# EAGLE design smogbuster-v2 (EAGLE 9.2.2)
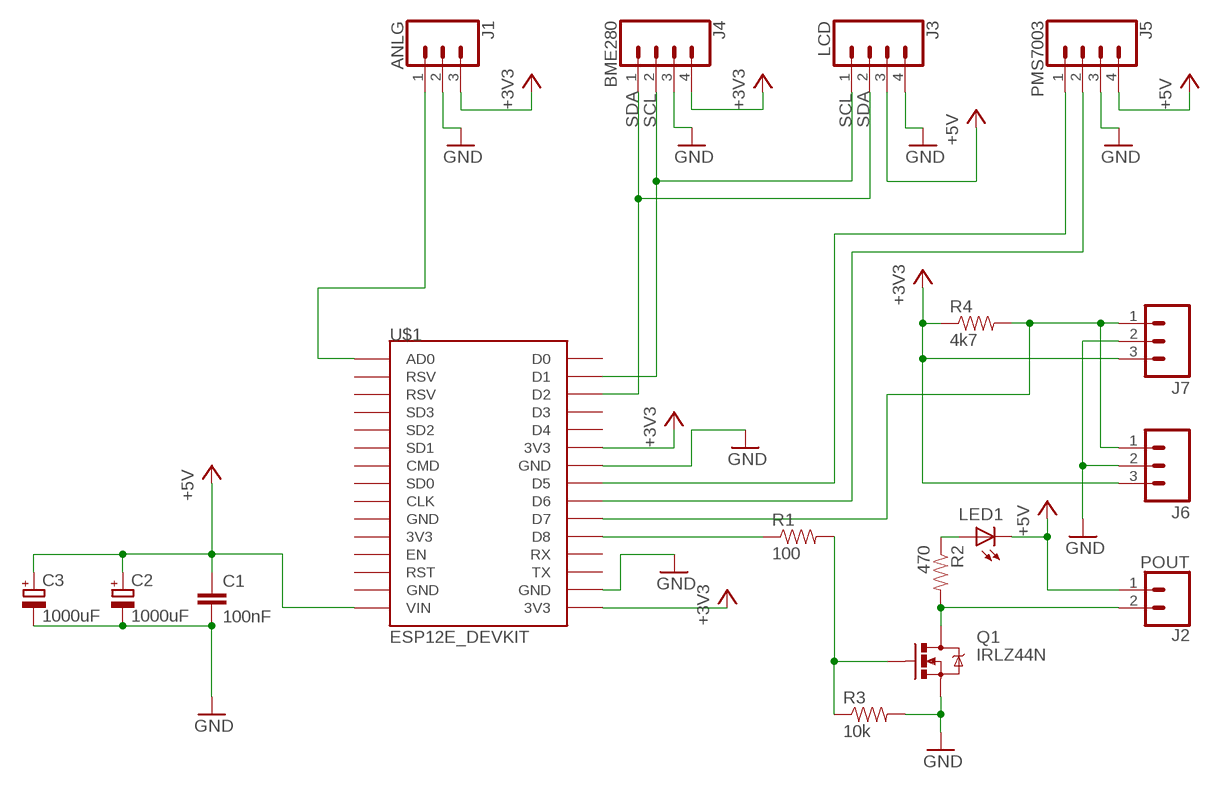
[diagram p0: schematic, sheet 1]

## Parts
C1  100nF  CAPPTH1  [CAP-PTH-5MM]
C2  1000uF  CPOL-EUE2.5-7  [E2,5-7]
C3  1000uF  CPOL-EUE2.5-7  [E2,5-7]
J1  ANLG  CONN_03  [1X03]
J2  POUT  CONN_02  [1X02]
J3  LCD  CONN_04  [1X04]
J4  BME280  CONN_04  [1X04]
J5  PMS7003  CONN_04  [1X04]
J6  M03PTH  [1X03]
J7  M03PTH  [1X03]
LED1  LED3MM  [LED3MM]
Q1  IRLZ44N  MOSFET-NCHANNELFQP30N06L  [TO220V]
R1  100  1KOHM-1/4W-1%(PTH)  [AXIAL-0.3]
R2  470  1KOHM-1/4W-1%(PTH)  [AXIAL-0.3]
R3  10k  1KOHM-1/4W-1%(PTH)  [AXIAL-0.3]
R4  4k7  1KOHM-1/4W-1%(PTH)  [AXIAL-0.3]
U$1  ESP12E_DEVKIT  [ESP12E_DEVKIT]

## Nets
+3V3: J1.3 J4.4 J6.3 J7.3 R4.P$1 U$1.3V3@1(3V3) U$1.3V3@2(3V3)
+5V: C1.1 C2.+ C3.+ J2.1 J3.3 J5.4 LED1.K(C) U$1.VIN
DQ: J6.1 J7.1 R4.P$2 U$1.D7
GND: C1.2 C2.- C3.- J1.2 J3.4 J4.3 J5.3 J6.2 J7.2 Q1.3(S) R3.P$2 U$1.GND@2(GND) U$1.GND@3(GND)
N$2: J2.2 Q1.2(D) R2.P$2
N$3: Q1.1(G) R1.P$2 R3.P$1
N$4: J1.1 U$1.AD0
N$5: R1.P$1 U$1.D8
N$9: LED1.A R2.P$1
RX: J5.1 U$1.D5
SCL: J3.1 J4.2 U$1.D1
SDA: J3.2 J4.1 U$1.D2
TX: J5.2 U$1.D6
Unconnected: U$1.3V3@0(3V3) U$1.CLK U$1.CMD U$1.D0 U$1.D3 U$1.D4 U$1.EN U$1.GND@0(GND) U$1.GND@1(GND) U$1.RST U$1.RSV@0(RSV) U$1.RSV@1(RSV) U$1.RX U$1.SD0 U$1.SD1 U$1.SD2 U$1.SD3 U$1.TX

## Library data of the parts
C1 = SparkFun-Capacitors:CAP: Capacitor Standard 0603 ceramic capacitor, and 0.1" leaded capacitor.
C2 C3 = rcl:CPOL-EU: POLARIZED CAPACITOR, European symbol; SPICEPREFIX: C
J1 = SparkFun-Connectors:CONN_03: Multi connection point. Often used as Generic Header-pin footprint for 0.1 inch spaced/style header connections On any of the 0.1 inch spaced packages, you can populate with these: Break Away Headers - Straight <https://www.sparkfun.com/products/116> (PRT-00116) Break Away Male Headers - Right Angle <https://www.sparkfun.com/products/553> (PRT-00553) Female Headers <https://www.sparkfun.com/products/115> (PRT-00115) Break Away Headers - Machine Pin <https://www.sparkfun.com/products/117> (PRT-00117) Break Away Female Headers - Swiss Machine Pin <https://www.sparkfun.com/products/743> (PRT-00743) Stackable Header - 3 Pin (Female, 0.1") <https://www.sparkfun.com/products/13875> (PRT-13875) For SCREWTERMINALS and SPRING TERMINALS visit here: Screw Terimnals on SparkFun.com <https://www.sparkfun.com/search/results?term=Screw+Terminals> (5mm/3.5mm/2.54mm spacing) This device is also useful as a general connection point to wire up your design to another part of your project. Our various solder wires solder well into these plated through hole pads. Hook-Up Wire - Assortment (Stranded, 22 AWG) <https://www.sparkfun.com/products/11375> (PRT-11375) Hook-Up Wire - Assortment (Solid Core, 22 AWG) <https://www.sparkfun.com/products/11367> (PRT-11367) View the entire wire category on our website here <https://www.sparkfun.com/categories/141> Special notes: Molex polarized connector foot print use with SKU : PRT-08232 with associated crimp pins and housings.
J2 = SparkFun-Connectors:CONN_02: Multi connection point. Often used as Generic Header-pin footprint for 0.1 inch spaced/style header connections On any of the 0.1 inch spaced packages, you can populate with these: Break Away Headers - Straight <https://www.sparkfun.com/products/116> (PRT-00116) Break Away Male Headers - Right Angle <https://www.sparkfun.com/products/553> (PRT-00553) Female Headers <https://www.sparkfun.com/products/115> (PRT-00115) Break Away Headers - Machine Pin <https://www.sparkfun.com/products/117> (PRT-00117) Break Away Female Headers - Swiss Machine Pin <https://www.sparkfun.com/products/743> (PRT-00743) For SCREWTERMINALS and SPRING TERMINALS visit here: Screw Terimnals on SparkFun.com <https://www.sparkfun.com/search/results?term=Screw+Terminals> (5mm/3.5mm/2.54mm spacing) This device is also useful as a general connection point to wire up your design to another part of your project. Our various solder wires solder well into these plated through hole pads. Hook-Up Wire - Assortment (Stranded, 22 AWG) <https://www.sparkfun.com/products/11375> (PRT-11375) Hook-Up Wire - Assortment (Solid Core, 22 AWG) <https://www.sparkfun.com/products/11367> (PRT-11367) View the entire wire category on our website here <https://www.sparkfun.com/categories/141> Special notes: Molex polarized connector foot print use with: PRT-08233 with associated crimp pins and housings. 2.54_SCREWTERM for use with PRT-10571. 3.5mm Screw Terminal footprints for PRT-08084 5mm Screw Terminal footprints for use with PRT-08432
J3-J5 = SparkFun-Connectors:CONN_04: Multi connection point. Often used as Generic Header-pin footprint for 0.1 inch spaced/style header connections On any of the 0.1 inch spaced packages, you can populate with these: Break Away Headers - Straight <https://www.sparkfun.com/products/116> (PRT-00116) Break Away Male Headers - Right Angle <https://www.sparkfun.com/products/553> (PRT-00553) Female Headers <https://www.sparkfun.com/products/115> (PRT-00115) Break Away Headers - Machine Pin <https://www.sparkfun.com/products/117> (PRT-00117) Break Away Female Headers - Swiss Machine Pin <https://www.sparkfun.com/products/743> (PRT-00743) For SCREWTERMINALS and SPRING TERMINALS visit here: Screw Terimnals on SparkFun.com <https://www.sparkfun.com/search/results?term=Screw+Terminals> (5mm/3.5mm/2.54mm spacing) This device is also useful as a general connection point to wire up your design to another part of your project. Our various solder wires solder well into these plated through hole pads. Hook-Up Wire - Assortment (Stranded, 22 AWG) <https://www.sparkfun.com/products/11375> (PRT-11375) Hook-Up Wire - Assortment (Solid Core, 22 AWG) <https://www.sparkfun.com/products/11367> (PRT-11367) View the entire wire category on our website here <https://www.sparkfun.com/categories/141> Special notes: Molex polarized connector foot print use with SKU : PRT-08231 with associated crimp pins and housings. 1MM SMD Version SKU: PRT-10208; PROD_ID: CONN-09696
J6 J7 = SparkFun-Connectors:M03: Header 3 Standard 3-pin 0.1" header. Use with straight break away headers (SKU : PRT-00116), right angle break away headers (PRT-00553), swiss pins (PRT-00743), machine pins (PRT-00117), and female headers (PRT-00115). Molex polarized connector foot print use with SKU : PRT-08232 with associated crimp pins and housings.
LED1 = led:LED: LED OSRAM: - CHIPLED LG R971, LG N971, LY N971, LG Q971, LY Q971, LO R971, LY R971 LH N974, LH R974 LS Q976, LO Q976, LY Q976 LO Q996 - Hyper CHIPLED LW Q18S LB Q993, LB Q99A, LB R99A - SideLED LS A670, LO A670, LY A670, LG A670, LP A670 LB A673, LV A673, LT A673, LW A673 LH A674 LY A675 LS A676, LA A676, LO A676, LY A676, LW A676 LS A679, LY A679, LG A679 - Hyper Micro SIDELED® LS Y876, LA Y876, LO Y876, LY Y876 LT Y87S - SmartLED LW L88C, LW L88S LB L89C, LB L89S, LG L890 LS L89K, LO L89K, LY L89K LS L896, LA L896, LO L896, LY L896 - TOPLED LS T670, LO T670, LY T670, LG T670, LP T670 LSG T670, LSP T670, LSY T670, LOP T670, LYG T670 LG T671, LOG T671, LSG T671 LB T673, LV T673, LT T673, LW T673 LH T674 LS T676, LA T676, LO T676, LY T676, LB T676, LH T676, LSB T676, LW T676 LB T67C, LV T67C, LT T67C, LS T67K, LO T67K, LY T67K, LW E67C LS E67B, LA E67B, LO E67B, LY E67B, LB E67C, LV E67C, LT E67C LW T67C LS T679, LY T679, LG T679 LS T770, LO T770, LY T770, LG T770, LP T770 LB T773, LV T773, LT T773, LW T773 LH T774 LS E675, LA E675, LY E675, LS T675 LS T776, LA T776, LO T776, LY T776, LB T776 LHGB T686 LT T68C, LB T68C - Hyper Mini TOPLED® LB M676 - Mini TOPLED Santana® LG M470 LS M47K, LO M47K, LY M47K Source: http://www.osram.convergy.de LUXEON: - LUMILED® LXK2-PW12-R00, LXK2-PW12-S00, LXK2-PW14-U00, LXK2-PW14-V00 LXK2-PM12-R00, LXK2-PM12-S00, LXK2-PM14-U00 LXK2-PE12-Q00, LXK2-PE12-R00, LXK2-PE12-S00, LXK2-PE14-T00, LXK2-PE14-U00 LXK2-PB12-K00, LXK2-PB12-L00, LXK2-PB12-M00, LXK2-PB14-N00, LXK2-PB14-P00, LXK2-PB14-Q00 LXK2-PR12-L00, LXK2-PR12-M00, LXK2-PR14-Q00, LXK2-PR14-R00 LXK2-PD12-Q00, LXK2-PD12-R00, LXK2-PD12-S00 LXK2-PH12-R00, LXK2-PH12-S00 LXK2-PL12-P00, LXK2-PL12-Q00, LXK2-PL12-R00 Source: www.luxeon.com KINGBRIGHT: KA-3528ASYC Source: www.kingbright.com
Q1 = SparkFun-DiscreteSemi:MOSFET-NCHANNEL: Common NMOSFET Parts MFG P/N Store ID Prod ID FDD8780 TRANS-09984 SI7820DN TRANS-11055 FDS6630A IC-08089 2N7002PW TRANS-11151 FQP30N06L COM-10213 TRANS-10060 BSS123LT1G TRANS-08345 BSS138 TRANS-00830 BS170 2N7000; PROD_ID: TRANS-10060
R1-R4 = SparkFun-Resistors:1KOHM-1/4W-1%(PTH): RES-12182; PROD_ID: RES-12182; VALUE: 1K
U$1 = esp12e-devkit-custom:ESP12E_DEVKIT: ESP12E DEVKIT BOARD; SPICEPREFIX: X

## Net classes
0 default: clearance 0.205 mm

## Board
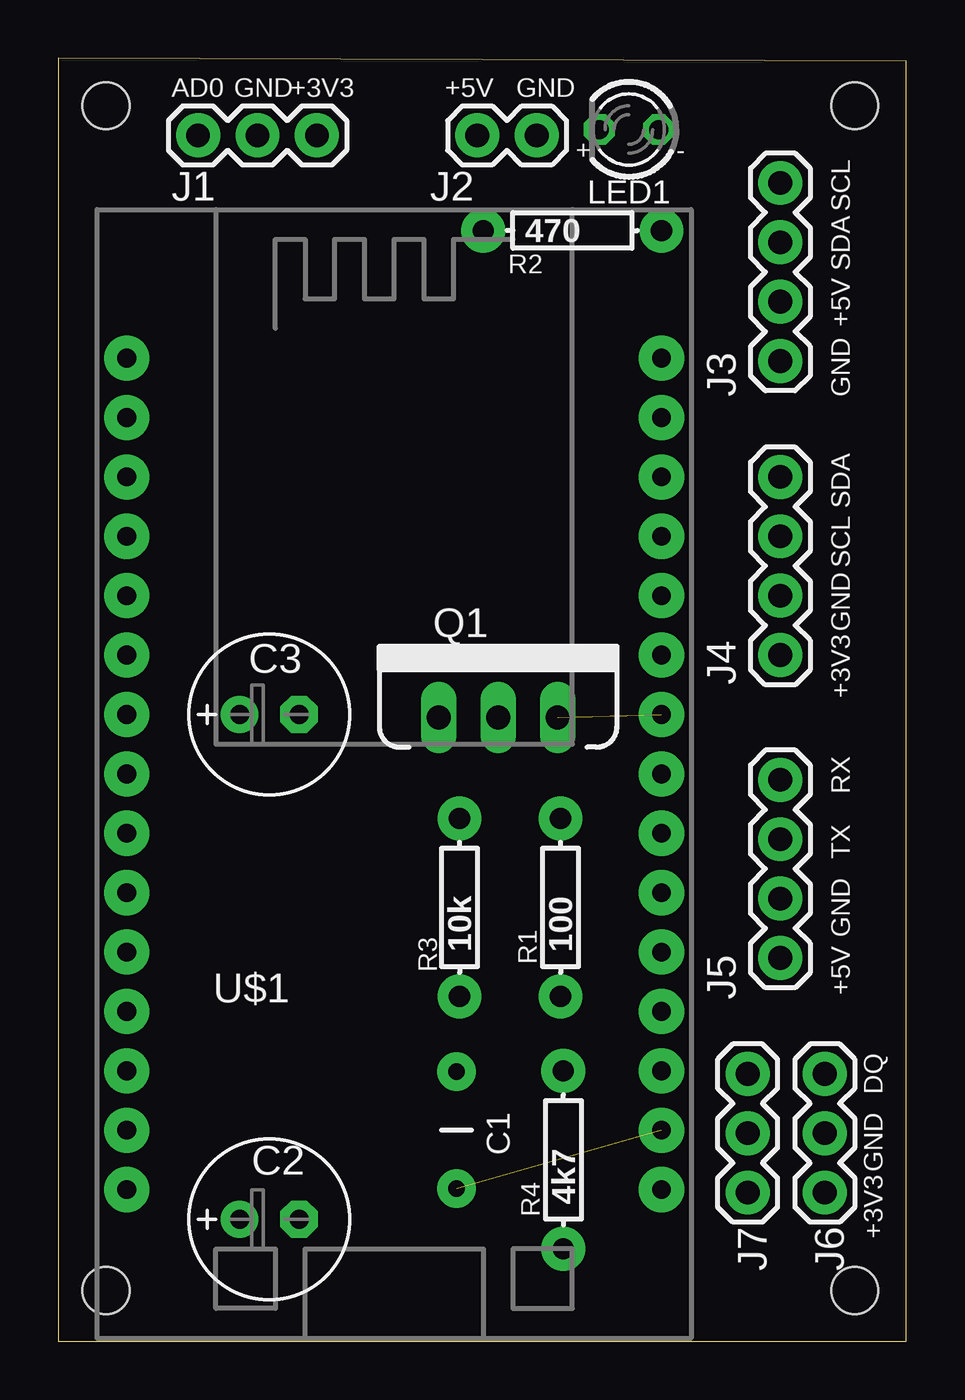
[diagram p1: board, top side]
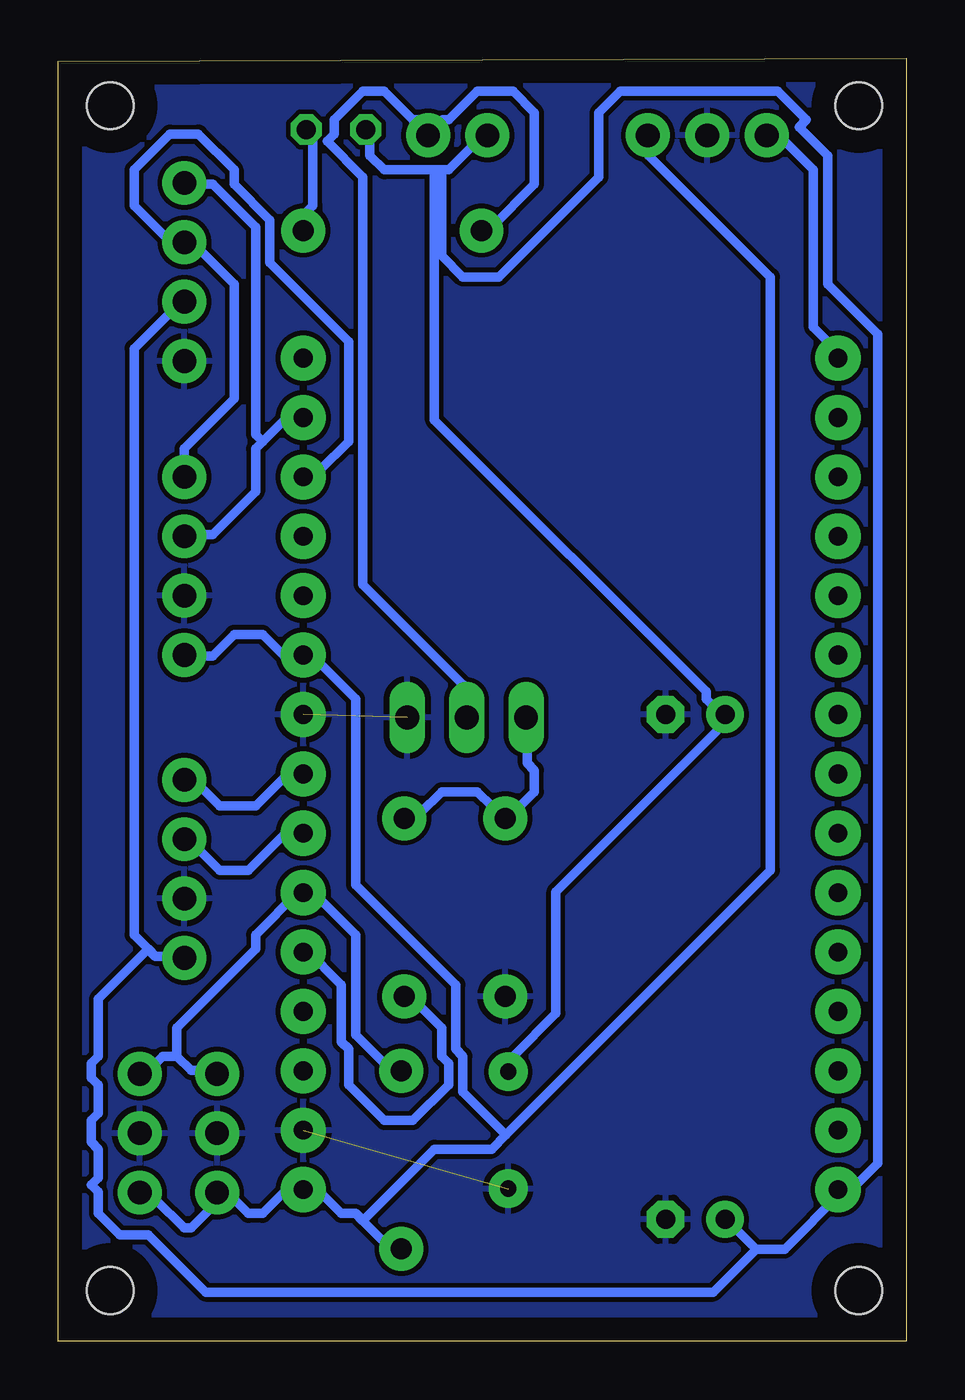
[diagram p2: board, bottom side, seen from below]

Size 36.25 x 54.85 mm. Coordinates in mm from the lower left corner, seen from the top.
Outline: 0,0 36.25,0 36.25,54.73 0,54.85 0,0
Copper layers 16: Bottom 0.035mm
Design rules "default *": minimum track width 16mil, minimum drill 24mil, track to track 6mil, track to pad 6mil, pad to pad 6mil, via to via 6mil, smd to smd 6mil, copper to edge 40mil, drill to drill 6mil, minimum pad ring 10mil, minimum via ring 8mil, stop-mask expansion 4mil, vias tented up to drill 0mil, thermal gap 10mil
Holes 2 mm at 2.03,52.83 34.04,52.83 34.04,2.16 2.03,2.16

### Footprints (pad centres in the part's own frame; a part is rotated, then mirrored left to right if it is on the bottom)
CAP-PTH-5MM = drill 0.7 pad 1.651: 1 -2.5,0; 2 2.5,0
E2,5-7 = drill 0.813 pad 1.6: + -1.27,0 | drill 0.813 pad 1.6 octagon: - 1.27,0
1X03 = drill 1.016 pad 1.88: 1 0,0; 2 2.54,0; 3 5.08,0
1X02 = drill 1.016 pad 1.88: 1 0,0; 2 2.54,0
1X04 = drill 1.016 pad 1.88: 1 0,0; 2 2.54,0; 3 5.08,0; 4 7.62,0
LED3MM = drill 0.813 octagon: A -1.27,0; K 1.27,0
TO220V = drill 1.016 long: 1 -2.54,0; 2 0,0; 3 2.54,0
AXIAL-0.3 = drill 0.9 pad 1.88: P$1 -3.81,0; P$2 3.81,0
ESP12E_DEVKIT = drill 0.8 pad 1.93: 3V3@0 -11.43,-7.62; 3V3@1 11.43,5.08; 3V3@2 11.43,-17.78; AD0 -11.43,17.78; CLK -11.43,-2.54; CMD -11.43,2.54; D0 11.43,17.78; D1 11.43,15.24; D2 11.43,12.7; D3 11.43,10.16; D4 11.43,7.62; D5 11.43,0; D6 11.43,-2.54; D7 11.43,-5.08; D8 11.43,-7.62; EN -11.43,-10.16; GND@0 -11.43,-5.08; GND@1 -11.43,-15.24; GND@2 11.43,2.54; GND@3 11.43,-15.24; RST -11.43,-12.7; RSV@0 -11.43,15.24; RSV@1 -11.43,12.7; RX 11.43,-10.16; SD0 -11.43,0; SD1 -11.43,5.08; SD2 -11.43,7.62; SD3 -11.43,10.16; TX 11.43,-12.7; VIN -11.43,-17.78

### Placement (x,y rotation side)
C1  17.02,9.02 270 top
C2  9.02,5.21 0 top
C3  9.02,26.8 0 top
J1  5.97,51.56 0 top
J2  17.91,51.56 0 top
J3  30.86,49.53 270 top
J4  30.86,36.96 270 top
J5  30.86,24 270 top
J6  32.77,11.43 270 top
J7  29.46,11.43 270 top
LED1  24.38,51.82 180 top
Q1  18.8,26.67 0 top
R1  21.46,18.54 90 top
R2  21.97,47.5 180 top
R3  17.14,18.54 270 top
R4  21.59,7.75 90 top
U$1  14.35,24.26 0 top

### Tracks (layer width: path | path; a pad name or v marks a point on that pad's centre or on a via)
+3V3
  Bottom 0.406: J4.4 30.57,29.3 29.65,29.3 28.74,30.22 27.51,30.22 26.6,29.3 25.98,29.3 U$1.3V3@1 25.68,29.3 25.37,29.3 23.54,27.47 23.54,19.52 19.26,15.24 19.26,12.49 18.95,12.18 18.95,10.65 17.12,8.82 | J6.3 32.71,6.07 32.1,6.07 30.88,4.84 30.57,4.84 29.65,5.76 29.65,6.07 J7.3 29.35,6.07 28.74,6.07 28.12,5.46 27.51,5.46 26.6,6.37 25.98,6.37 U$1.3V3@2 25.68,6.37 25.07,6.37 24.15,5.46 23.54,5.46 23.23,5.15 | 23.23,5.15 22.32,4.23 21.7,4.23 R4.P$1 | 17.12,8.82 17.73,8.21 20.18,8.21 23.23,5.15 | 17.12,8.82 5.81,20.13 5.81,45.5 11.01,50.7 11.01,51.54 J1.3
+5V
  Bottom 0.406: 19.87,50.09 19.57,50.09 17.93,51.73 J2.1 | 19.87,50.09 20.18,50.09 | 20.18,50.09 22.32,50.09 22.93,50.7 22.93,51.79 LED1.K | C1.1 16.81,11.57 16.81,12.18 14.98,14.02 14.98,19.21 7.95,26.24 7.95,26.55 C3.+ 7.64,26.85 7.95,27.16 8.25,27.16 8.56,27.47 8.56,27.77 20.18,39.39 20.18,50.09 | 6.42,3.93 7.64,5.15 C2.+ | 6.42,3.93 5.2,3.93 2.75,6.37 U$1.VIN 2.75,6.68 2.14,6.68 1.22,7.6 1.22,43.06 3.36,45.2 3.36,50.7 4.58,51.92 4.28,52.23 5.5,53.45 12.23,53.45 13.14,52.53 13.14,49.78 17.43,45.5 18.95,45.5 19.87,46.42 19.87,50.09 | 32.4,16.77 33.02,17.38 33.02,42.45 30.88,44.58 J3.3 | 32.4,16.77 32.1,16.46 30.88,16.46 J5.4 | 6.42,3.93 8.25,2.09 29.96,2.09 32.4,4.54 33.63,4.54 34.54,5.46 34.54,6.37 34.85,6.68 34.54,6.98 34.54,8.21 34.85,8.51 34.85,9.43 34.54,9.74 34.54,10.96 34.85,11.26 34.85,11.88 34.54,12.18 34.54,14.63 32.4,16.77
DQ
  Bottom 0.406: 31.18,12.18 30.57,11.57 29.65,11.57 J7.1 | 31.18,12.18 31.79,12.18 32.71,11.26 J6.1 | R4.P$2 21.7,11.57 22.01,11.57 23.54,13.1 23.54,17.38 25.07,18.91 25.68,18.91 U$1.D7 25.98,19.21 27.82,17.38 27.82,16.77 31.18,13.4 31.18,12.18
GND  (2 unrouted)
  pour Bottom: 0,54.61 0,0 36.45,0 36.45,54.61
N$2
  Bottom 0.406: Q1.2 18.95,26.85 18.95,28.08 23.23,32.36 23.23,49.78 24.76,51.31 24.46,51.62 24.46,52.23 23.23,53.45 22.32,53.45 21.09,52.23 20.53,52.23 J2.2 19.81,52.23 19.57,52.23 18.34,53.45 16.81,53.45 15.9,52.53 15.9,49.48 17.73,47.64 18.04,47.64 R2.P$2
N$3
  Bottom 0.406: Q1.1 16.2,26.55 16.2,24.71 15.9,24.41 15.9,23.49 17.12,22.27 R3.P$1 17.12,22.57 17.43,22.88 17.73,22.88 18.34,23.49 19.87,23.49 20.79,22.57 21.4,22.57 R1.P$2
N$4
  Bottom 0.406: J1.1 5.37,51.48 3.97,50.09 3.97,43.36 2.75,42.14 U$1.AD0
N$5
  Bottom 0.406: R1.P$1 21.4,14.63 21.09,14.63 19.87,13.4 19.87,12.18 19.57,11.88 19.57,10.96 21.09,9.43 22.32,9.43 23.84,10.96 23.84,12.49 24.15,12.79 24.15,15.24 25.68,16.77 U$1.D8
N$9
  Bottom 0.406: LED1.A 25.37,51.79 25.37,48.56 25.68,48.25 25.68,47.64 R2.P$1
RX
  Bottom 0.406: J5.1 30.57,23.8 30.26,23.8 29.35,22.88 27.82,22.88 26.6,24.1 25.98,24.1 U$1.D5
SCL
  Bottom 0.406: 27.51,38.47 26.6,39.39 25.98,39.39 U$1.D1 | 27.51,38.47 27.82,38.16 27.82,36.33 29.65,34.5 30.57,34.5 J4.2 | 27.51,38.47 27.82,38.78 27.82,47.64 29.65,49.48 30.57,49.48 J3.1
SDA
  Bottom 0.406: J4.1 30.88,37.25 30.88,38.16 28.74,40.3 28.74,45.2 30.57,47.03 J3.2 30.88,47.03 31.49,47.03 33.02,48.56 33.02,50.09 31.49,51.62 30.26,51.62 28.74,50.09 28.74,49.48 27.21,47.95 27.21,46.11 23.84,42.75 23.84,38.47 25.07,37.25 25.68,37.25 U$1.D2
TX
  Bottom 0.406: J5.2 30.57,21.35 29.35,20.13 28.12,20.13 26.6,21.66 25.98,21.66 U$1.D6

### Text on the board
tNames: AD0 | GND | +3V3 | +5V | GND | + | - | SCL | SDA | +5V | GND | SDA | SCL | GND | +3V3 | RX | TX | GND | +5V | DQ | GND | +3V3